# Altium project RF_ID_Schematic.PrjPcb
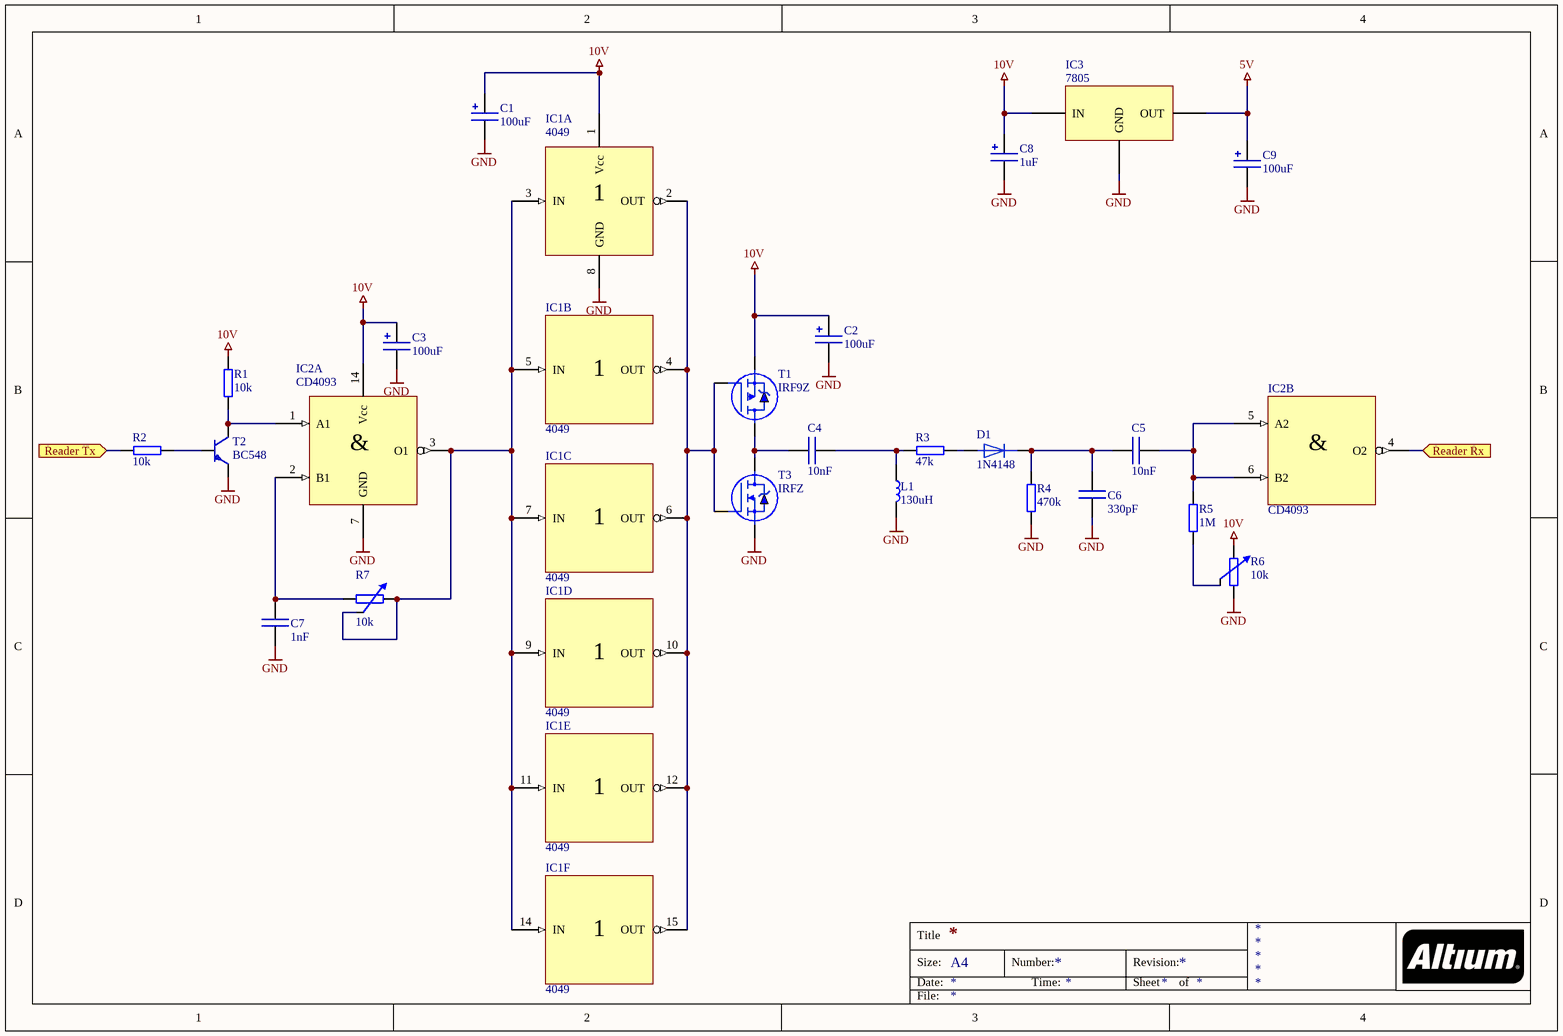
[diagram p0: Reader_Schematic.SchDoc]
2 sheets, 46 parts. Net scope: flat (ports and power ports of the same name join across sheets).
Sheets:
  Reader_Schematic.SchDoc
  Tag_Schematic.SchDoc

## Sheet Reader_Schematic.SchDoc
size A4

### Parts
C1  100uF  [ELKO_10_5.0]
C2  100uF  [ELKO_10_5.0]
C3  100uF  [ELKO_10_5.0]
C4  10nF  [0805]
C5  10nF  [0805]
C6  330pF  [0805]
C7  1nF  [0805]
C8  1uF  [ELKO_10_5.0]
C9  100uF  [ELKO_10_5.0]
D1  1N4148
IC1  4049  (parts A,B,C,D,E,F of 6)
IC2  CD4093  (parts A,B of 4)
IC3  7805
L1  130uH
R1  10k  [Axial-04]
R2  10k  [Axial-04]
R3  47k  [Axial-04]
R4  470k  [Axial-04]
R5  1M  [Axial-04]
R6  10k
R7  10k
T1  IRF9Z  [NDS0610]
T2  BC548  [2SC3324]
T3  IRFZ  [SOT-23]

### Ports
Reader Rx (in), Reader Tx (in)

### Nets
5V: C9.1 IC3.2(OUT)
10V: C1.1 C2.1 C3.1 C8.1 IC1.1(Vcc) IC2.14(Vcc) IC3.1(IN) R1.2 R6.2 T1.2(Source)
GND: C1.2 C2.2 C3.2 C6.1 C7.1 C8.2 C9.2 IC1.8(GND) IC2.7(GND) IC3.3(GND) L1.1 R4.1 R6.1 T2.2(Emitter) T3.3(Source)
NetC4_1: C4.1 T1.3(Drain) T3.2(Drain)
NetC4_2: C4.2 L1.2 R3.1
NetC5_1: C5.1 C6.2 D1.2(Kathode) R4.2
NetC5_2: C5.2 IC2.5(A2) IC2.6(B2) R5.2
NetC7_2: C7.2 IC2.2(B1) R7.1
NetD1_1: D1.1(Anode) R3.2
NetIC1_2: IC1.2(OUT) IC1.4(OUT) IC1.6(OUT) IC1.10(OUT) IC1.12(OUT) IC1.15(OUT) T1.1(Gate) T3.1(Gate)
NetIC1_3: IC1.3(IN) IC1.5(IN) IC1.7(IN) IC1.9(IN) IC1.11(IN) IC1.14(IN) IC2.3(O1) R7.2 R7.3
NetIC2_1: IC2.1(A1) R1.1 T2.3(Collector)
NetIC2_4: IC2.4(O2) ; port Reader Rx
NetR2_1: R2.1 ; port Reader Tx
NetR2_2: R2.2 T2.1(Base)
NetR5_1: R5.1 R6.3

### Notes on the sheet
- Title
- Size:
- Date:
- A4
- Number:
- Time:
- Revision:
- Sheet
- of
- File:
- (in symbol 4093, part A) &
- (in symbol 4093, part B) &

### Library data of the parts
C1-C3 C8 C9 = Elko
  C1-C3 C9: VALUE: 100uF
  C8: VALUE: 1uF
C4-C7 = Cap
  C4 C5: VALUE: 10nF
  C6: VALUE: 330pF
  C7: VALUE: 1nF
D1 = Diode
IC1 = 4049: Hex Inverter
IC2 = 4093: Quad NAND with Schmitt Output
IC3 = 7805: 5V Voltage regulator
L1 = Inductor: Value: 130uH
R1-R5 = Res
  R1 R2: VALUE: 10k
  R3: VALUE: 47k
  R4: Value: 470k
  R5: Value: 1M
R6 R7 = Potentiometer
T1 = MOSFET P-Channel
T2 = NPN
T3 = MOSFET N-Channel: pin to pad: 2>3 3>2

## Sheet Tag_Schematic.SchDoc
size A4
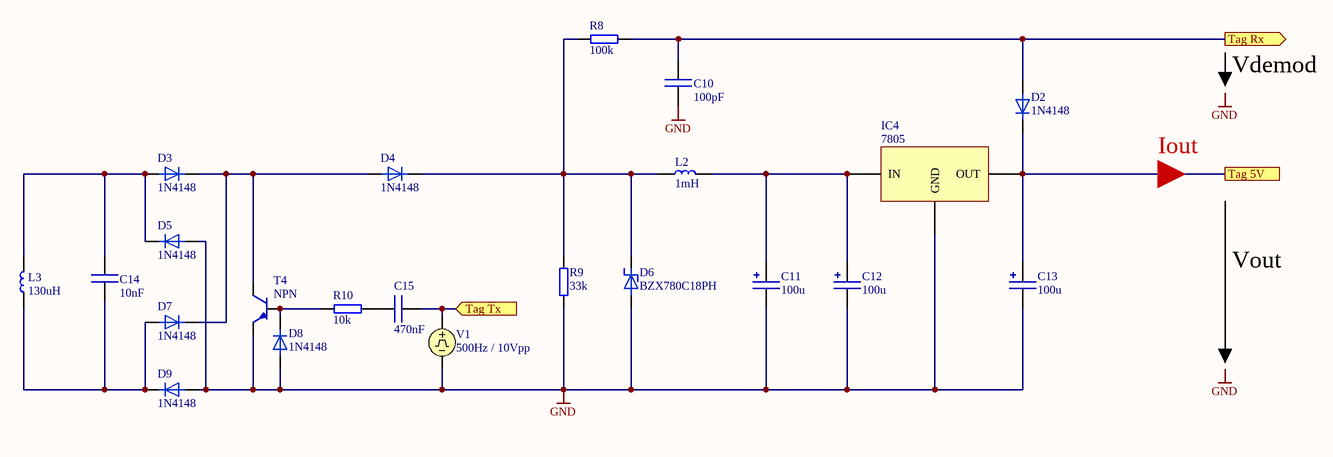
[diagram p1: Tag_Schematic.SchDoc]

### Parts
C10  100pF  [0805]
C11  100u  [ELKO_10_5.0]
C12  100u  [ELKO_10_5.0]
C13  100u  [ELKO_10_5.0]
C14  10nF  [0805]
C15  470nF  [0805]
D2  1N4148
D3  1N4148
D4  1N4148
D5  1N4148
D6  BZX780C18PH
D7  1N4148
D8  1N4148
D9  1N4148
IC4  7805
L2  1mH
L3  130uH
R8  100k  [Axial-04]
R9  33k  [Axial-04]
R10  10k  [Axial-04]
T4  NPN  [2SC3324]
V1  500Hz / 10Vpp

### Ports
Tag 5V, Tag Rx (out), Tag Tx (in)

### Nets
GND: C10.1 C11.2 C12.2 C13.2 D5.1(Anode) D6.1(Anode) D8.1(Anode) D9.1(Anode) IC4.3(GND) R9.1 T4.2(Emitter) V1.2
NetC10_2: C10.2 D2.1(Anode) R8.2 ; port Tag Rx
NetC11_1: C11.1 C12.1 IC4.1(IN) L2.1
NetC13_1: C13.1 D2.2(Kathode) IC4.2(OUT) ; port Tag 5V
NetC14_1: C14.1 D7.1(Anode) D9.2(Kathode) L3.2
NetC14_2: C14.2 D3.1(Anode) D5.2(Kathode) L3.1
NetC15_1: C15.1 R10.2
NetC15_2: C15.2 V1.1 ; port Tag Tx
NetD3_2: D3.2(Kathode) D4.1(Anode) D7.2(Kathode) T4.3(Collector)
NetD4_2: D4.2(Kathode) D6.2(Kathode) L2.2 R8.1 R9.2
NetD8_2: D8.2(Kathode) R10.1 T4.1(Base)

### Notes on the sheet
- Vdemod
- Iout
- Vout
- Labels drawn without touching a wire or pin: GND
- Title
- Size:
- Date:
- A4
- Number:
- Time:
- Revision:
- Sheet
- of
- File:

### Library data of the parts
C10 C14 C15 = Cap
  C10: VALUE: 100pF
  C14: VALUE: 10nF
  C15: VALUE: 470nF
C11-C13 = Elko: VALUE: 100u
D2-D5 D7-D9 = Diode
D6 = Z-Diode
IC4 = 7805: 5V Voltage regulator
L2 L3 = Inductor
  L2: Value: 1mH
  L3: Value: 130uH
R8-R10 = Res
  R8: Value: 100k
  R9: Value: 33k
  R10: Value: 10k
V1 = VPULSE: Pulse Voltage Source; Note: PCB Footprint - Not required; Published: 8-Jun-2000; LatestRevisionDate: 15-Nov-2004; LatestRevisionNote: Corrected Netlist.; PackageReference: Not Applicable; Publisher: Altium Limited

## Nets that join several sheets
GND: Reader_Schematic (15 pins), Tag_Schematic (12 pins)